# Altium schematic sheet power.SchDoc
size A4; SheetNumber: 5; SheetTotal: 8
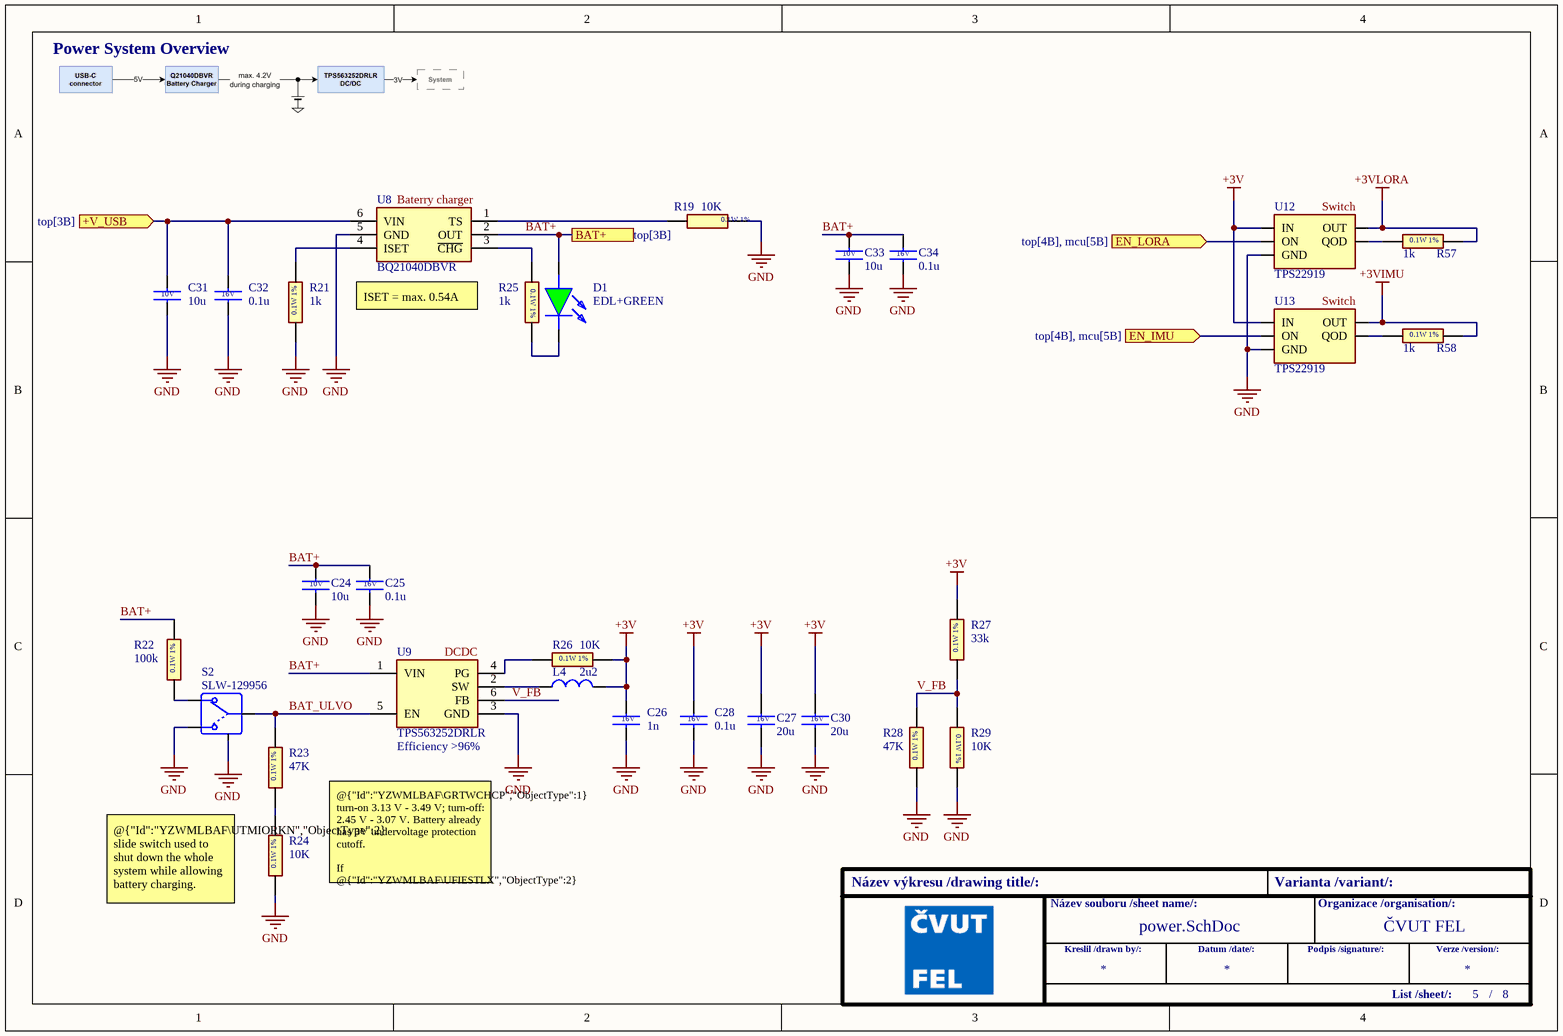
[diagram p0: power.SchDoc]

## Parts
C24  10u  [C0603]
C25  0.1u  [CAPC1608X95N]
C26  1n  [CAPC1608X87N]
C27  20u  [C0603]
C28  0.1u  [CAPC1608X95N]
C30  20u  [C0603]
C31  10u  [C0603]
C32  0.1u  [CAPC1608X95N]
C33  10u  [C0603]
C34  0.1u  [CAPC1608X95N]
D1  EDL+GREEN  [LEDM2012X80N]
L4  2u2  [INDPM5752X300N]
R19  10K  [RESC1608X50N]
R21  1k  [RESC1608X50N]
R22  100k  [RESC1608X55N]
R23  47K  [RESC1608X50N]
R24  10K  [RESC1608X50N]
R25  1k  [RESC1608X50N]
R26  10K  [RESC1608X50N]
R27  33k  [RESC1608X55N]
R28  47K  [RESC1608X50N]
R29  10K  [RESC1608X50N]
R57  1k  [RESC1608X50N]
R58  1k  [RESC1608X50N]
S2  SLW-129956  [SLW1299564ARAND]
U8  BQ21040DBVR  [SOT95P280X145-6N]
U9  TPS563252DRLR  [SOTFL50P160X60-6N]
U12  TPS22919  [SOT65P210X110-6N]
U13  TPS22919  [SOT65P210X110-6N]

## Ports
+V_USB (in, see top[3B]), BAT+ (see top[3B]), EN_IMU (in, see top[4B], mcu[5B]), EN_LORA (in, see top[4B], mcu[5B])

## Nets
+3V: C26.1 C27.1 C28.1 C30.1 L4.2 R26.2 R27.2 U12.1(IN) U13.1(IN)
+3VIMU: R58.2 U13.6(OUT)
+3VLORA: R57.2 U12.6(OUT)
GND: C24.2 C25.2 C26.2 C27.2 C28.2 C30.2 C31.2 C32.2 C33.2 C34.2 R19.1 R21.1 R24.1 R28.1 R29.2 S2.3(NO) S2.4(MH1) U8.5(GND) U9.3(GND) U12.2(GND) U13.2(GND)
+V_USB: C31.1 C32.1 U8.6(VIN) ; port +V_USB
BAT+: C24.1 C25.1 C33.1 C34.1 D1.1(K) R22.2 U8.2(OUT) U9.1(VIN) ; port BAT+
BAT_ULVO: R23.2 S2.2(COM) U9.5(EN)
EN_IMU: U13.3(ON) ; port EN_IMU
EN_LORA: U12.3(ON) ; port EN_LORA
V_FB: R27.1 R28.2 R29.1 U9.6(FB)
NetD1_2: D1.2(A) R25.2
NetL4_1: L4.1 U9.2(SW)
NetR19_2: R19.2 U8.1(TS)
NetR21_2: R21.2 U8.4(ISET)
NetR22_1: R22.1 S2.1(NO)
NetR23_1: R23.1 R24.2
NetR25_1: R25.1 U8.3(~{CHG})
NetR26_1: R26.1 U9.4(PG)
NetR57_1: R57.1 U12.5(QOD)
NetR58_1: R58.1 U13.5(QOD)

## Notes on the sheet
- Power System Overview
- (near U8) Baterry charger
- (near U12) Switch
- ISET = max. 0.54A
- (near U13) Switch
- (near U9) DCDC
- (near U9) Efficiency >96%
- @{"Id":"YZWMLBAF\UTMIORKN","ObjectType":2} slide switch used to shut down the whole system while allowing battery charging.
- @{"Id":"YZWMLBAF\GRTWCHCP","ObjectType":1} turn-on 3.13 V - 3.49 V; turn-off: 2.45 V - 3.07 V. Battery already has 3V undervoltage protection cutoff.
  If @{"Id":"YZWMLBAF\UFIESTLX","ObjectType":2} or @{"Id":"YZWMLBAF\HEYEGITT","ObjectType":2} NOT placed ULVO is deactivated.
- Název výkresu /drawing title/:
- Název souboru /sheet name/:
- Varianta /variant/:
- Organizace /organisation/:
- ČVUT FEL
- Kreslil /drawn by/:
- Datum /date/:
- Podpis /signature/:
- List /sheet/:
- Verze /version/:
- /
- (in symbol ECK+1n16V) 16V
- (in symbol ECK+10u10V) 10V
- (in symbol ECK+20u16V) 16V
- (in symbol ECK+100n16V) 16V
- (in symbol ER+1K) 0.1W 1%
- (in symbol ER+10K) 0.1W 1%
- (in symbol ER+33k) 0.1W 1%
- (in symbol ER+47K) 0.1W 1%
- (in symbol ER+100k) 0.1W 1%

## Library data of the parts
C24 C31 C33 = ECK+10u10V: 10 VDC, 20 %, X5R; Manufacturer_Name: KEMET; Manufacturer_Part_Number: C0603C106M8PACTU; Datasheet Link: https://content.kemet.com/datasheets/KEM_C1006_X5R_SMD.pdf; Height: 0.87mm; Mouser Part Number: 80-C0603C106M8PACTU; Mouser Price/Stock: https://www.mouser.co.uk/ProductDetail/KEMET/C0603C106M8PACTU?qs=gt1LBUVyoHk6B7S%252BOYJa0A%3D%3D; Arrow Part Number: C0603C106M8PACTU; Arrow Price/Stock: https://www.arrow.com/en/products/c0603c106m8pactu/kemet-corporation?region=nac
C25 C28 C32 C34 = ECK+100n16V: 16V 0.1uF XR7 0603 10%; Manufacturer_Name: KEMET; Manufacturer_Part_Number: C0603C104K4RAC-TU; Datasheet Link: https://connect.kemet.com:7667/gateway/IntelliData-ComponentDocumentation/1.0/download/specsheet/C0603C104K4RACTU; Height: 0.95mm; Mouser Part Number: 80-C0603C104K4RAC; Arrow Part Number: C0603C104K4RAC-TU; Arrow Price/Stock: https://www.arrow.com/en/products/c0603c104k4ractu/kemet-corporation
C26 = ECK+1n16V: 16 VDC, 10 %, X7R; Manufacturer_Name: KEMET; Manufacturer_Part_Number: C0603C102K4RECTU; Datasheet Link: https://content.kemet.com/datasheets/KEM_C1090_X7R_ESD.pdf; Height: 0.87mm
C27 C30 = ECK+20u16V: Capacitor; Manufacturer_Name: Yageo Group; Manufacturer_Part_Number: C0603C200K4HACAUTO; Datasheet Link: https://www.yageogroup.com/content/datasheet/asset/file/KEM_C1007_X8R_ULTRA_150C_SMD; Height: 0.87mm; Mouser Part Number: 80-C0603C200K4HAUTO; Mouser Price/Stock: https://www.mouser.co.uk/ProductDetail/KEMET/C0603C200K4HACAUTO?qs=j%252B1pi9TdxUZOUXgrptGPiw%3D%3D; Arrow Part Number: C0603C200K4HACAUTO; Arrow Price/Stock: https://www.arrow.com/en/products/c0603c200k4hacauto/kemet-corporation?utm_currency=USD&region=nac
D1 = EDL+GREEN: LED GREEN,  3.2 V; Manufacturer_Name: Wurth Elektronik; Manufacturer_Part_Number: 150080GS75000; Datasheet Link: https://katalog.we-online.com/led/datasheet/150080GS75000.pdf; Height: 0.8mm; Mouser Part Number: 710-150080GS75000; Mouser Price/Stock: https://www.mouser.co.uk/ProductDetail/Wurth-Elektronik/150080GS75000?qs=2kOmHSv6VfQRoTEZVk1mGA%3D%3D
L4 = EL+2.2u5.5A: Power Inductors - SMD 2.2uH 20%; Manufacturer_Name: Bourns; Manufacturer_Part_Number: SRP5030TA-2R2M; Datasheet Link: https://cz.mouser.com/datasheet/3/40/1/srp5030ta.pdf; Mouser Part Number: 652-SRP5030TA-2R2M; Mouser Price/Stock: https://cz.mouser.com/ProductDetail/Bourns/SRP5030TA-2R2M?qs=ZwKJWZfDtNgb6JbyacG30w%3D%3D
R19 R24 R26 R29 = ER+10K: Resistor 1%, 0.1W; Manufacturer_Name: Vishay; Manufacturer_Part_Number: CRCW060310K0FKEA; Datasheet Link: http://www.vishay.com/docs/20035/dcrcwe3.pdf; Height: 0.5mm; Mouser Part Number: 71-CRCW0603-10K-E3; Mouser Price/Stock: https://www.mouser.co.uk/ProductDetail/Vishay-Dale/CRCW060310K0FKEA?qs=pAO1Z172M84BVnhDjtnsoQ%3D%3D; Arrow Part Number: CRCW060310K0FKEA; Arrow Price/Stock: https://www.arrow.com/en/products/crcw060310k0fkea/vishay?region=europe
R21 R25 R57 R58 = ER+1K: Resistor 1%, 0.1W; Manufacturer_Name: Vishay; Manufacturer_Part_Number: CRCW06031K00FKEA; Datasheet Link: http://www.vishay.com/docs/20035/dcrcwe3.pdf; Height: 0.5mm; Mouser Part Number: 71-CRCW0603-1.0K-E3; Mouser Price/Stock: https://www.mouser.co.uk/ProductDetail/Vishay-Dale/CRCW06031K00FKEA?qs=CToX950LohJasujQx7GY3g%3D%3D; Arrow Part Number: CRCW06031K00FKEA; Arrow Price/Stock: https://www.arrow.com/en/products/crcw06031k00fkea/vishay?region=europe
R22 = ER+100k: Thick Film Resistors 0603 - SMD 1/10Watt 100Kohms 1% Commercial Use; Manufacturer_Name: Yageo Group; Manufacturer_Part_Number: AC0603FR-10100KL; Datasheet Link: https://www.yageo.com/upload/media/product/productsearch/datasheet/rchip/PYu-AC_51_RoHS_L_10.pdf; Height: 0.55mm; Mouser Part Number: 603-AC0603FR-10100KL; Mouser Price/Stock: https://www.mouser.com/Search/Refine.aspx?Keyword=603-AC0603FR-10100KL
R23 R28 = ER+47K: Resistor 1%, 0.1W; Manufacturer_Name: Vishay; Manufacturer_Part_Number: CRCW060347K0FKEA; Datasheet Link: http://www.vishay.com/docs/20035/dcrcwe3.pdf; Height: 0.5mm; Mouser Part Number: 71-CRCW0603-47K-E3; Mouser Price/Stock: https://www.mouser.co.uk/ProductDetail/Vishay-Dale/CRCW060347K0FKEA?qs=yJVtgANCw03gcaACf6JZKA%3D%3D; Arrow Part Number: CRCW060347K0FKEA; Arrow Price/Stock: https://www.arrow.com/en/products/crcw060347k0fkea/vishay?region=nac
R27 = ER+33k: Thick Film Resistors - SMD General Purpose Chip Resistor 0603, 33kOhms, 1%, 1/10W; Manufacturer_Name: Yageo Group; Manufacturer_Part_Number: RC0603FR-1333KL; Datasheet Link: http://www.yageo.com/documents/recent/PYu-RC0603_51_RoHS_L_v5.pdf; Height: 0.55mm; Mouser Part Number: 603-RC0603FR-1333KL; Mouser Price/Stock: https://www.mouser.co.uk/ProductDetail/Yageo/RC0603FR-1333KL?qs=IuGqVx9wL0LwIipsoMfsXg%3D%3D
S2 = ESW-SLW-129956: Slide Switch, Right Angle, max. 50 VDC, max. 300 mA, ON - ON; pin to pad: 4>4+5; Manufacturer_Name: Same Sky; Manufacturer_Part_Number: SLW-129956-4A-RA-N-D; Datasheet Link: https://www.sameskydevices.com/product/resource/slw-129956-4a-ra-n-d.pdf; Height: 6.3mm; Mouser Part Number: 179-SLW1299564ARAND; Mouser Price/Stock: https://www.mouser.co.uk/ProductDetail/Same-Sky/SLW-129956-4A-RA-N-D?qs=IKkN%2F947nfAoCoaoyLYE3A%3D%3D
U8 = EU+BQ21040DBVR: Battery Management 1-cell 0.8-A Li-ion and Li-polymer batt A 595-BQ21040DBVT; Manufacturer_Name: Texas Instruments; Datasheet Link: http://www.ti.com/lit/gpn/bq21040; Height: 1.45mm; Manufacturer_Part_Number: BQ21040DBVR; Mouser Part Number: 595-BQ21040DBVR; Mouser Price/Stock: https://www.mouser.co.uk/ProductDetail/Texas-Instruments/BQ21040DBVR?qs=cttFivMKqWyovUuY6Xwwcw%3D%3D; Arrow Part Number: BQ21040DBVR; Arrow Price/Stock: https://www.arrow.com/en/products/bq21040dbvr/texas-instruments?utm_currency=USD&region=nac
U9 = EU+TPS563252DRLR: Switching Voltage Regulators 3-V to 17-V input vo ltage 3-A 1.2-Mhz; Manufacturer_Name: Texas Instruments; Datasheet Link: https://www.ti.com/lit/ds/symlink/tps563252.pdf?ts=1715244064437&ref_url=https%253A%252F%252Fwww.mouser.in%252F; Height: 0.6mm; Manufacturer_Part_Number: TPS563252DRLR; Mouser Part Number: 595-TPS563252DRLR; Mouser Price/Stock: https://www.mouser.co.uk/ProductDetail/Texas-Instruments/TPS563252DRLR?qs=ulEaXIWI0c%252BIcG7y3AlP5A%3D%3D; Arrow Part Number: TPS563252DRLR; Arrow Price/Stock: https://www.arrow.com/en/products/tps563252drlr/texas-instruments?utm_currency=USD&region=nac
U12 U13 = EU+TPS22919: Power Switch ICs - Power Distribution 1-ch 5.5V 1.5A 90 mOhm self-protected AE; Manufacturer_Name: Texas Instruments; Manufacturer_Part_Number: TPS22919QDCKRQ1; Datasheet Link: https://www.ti.com/lit/gpn/tps22919-q1; Height: 1.1mm; Mouser Part Number: 595-TPS22919QDCKRQ1; Mouser Price/Stock: https://cz.mouser.com/ProductDetail/Texas-Instruments/TPS22919QDCKRQ1?qs=sGAEpiMZZMvjbjwkTuU2aX%252BB0PF2SxcjkwPe0jmTNxcgLPqTFcsPcA%3D%3D